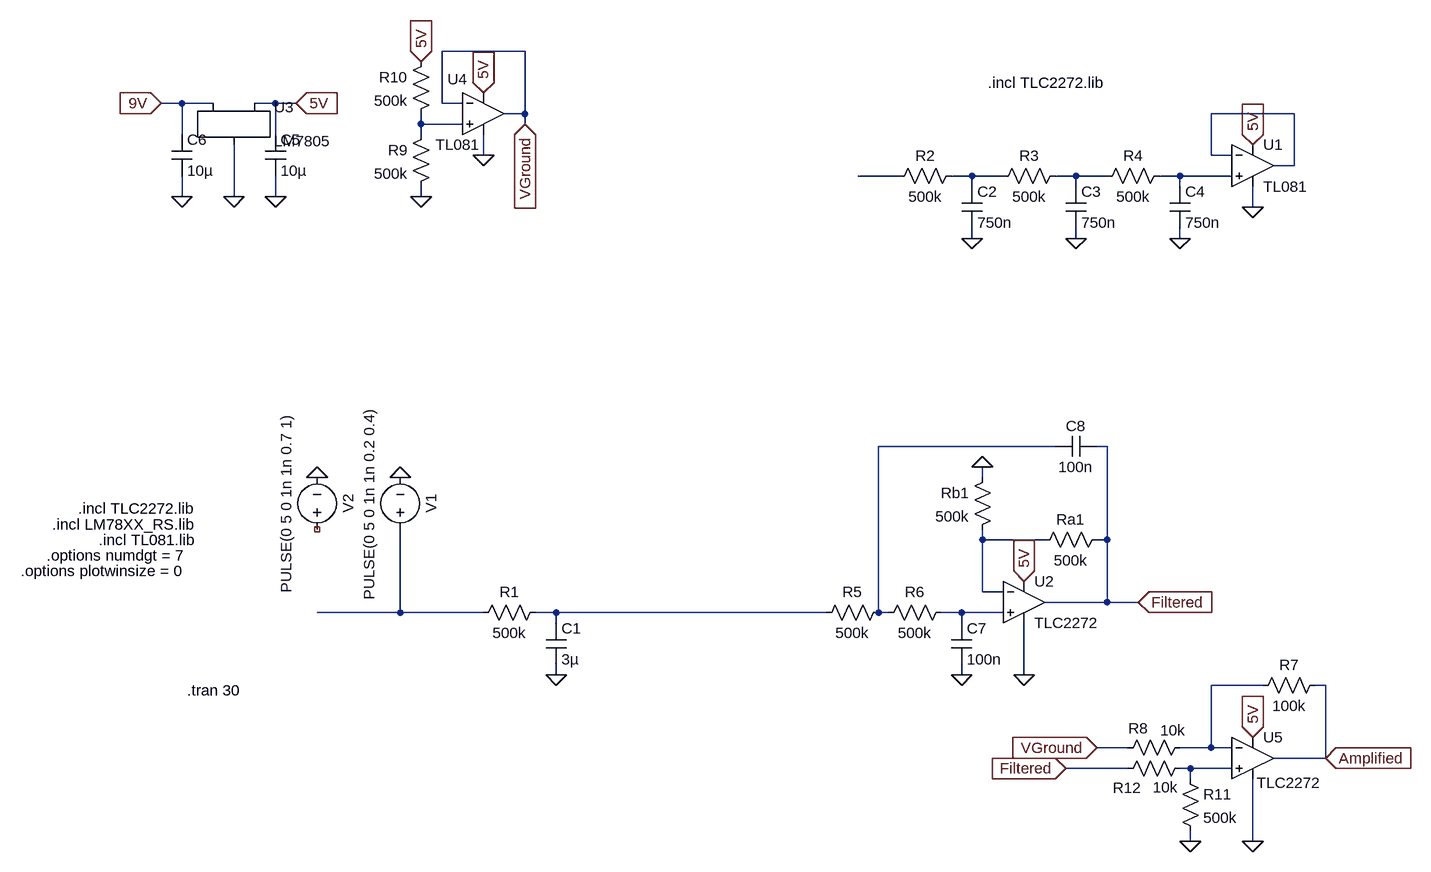
[diagram p0: schematic X_2ndOrderBPF_Schmitt - Copy.asc]
X_2ndOrderBPF_Schmitt - Copy.asc, the LTspice schematic file:
Version 4
SHEET 1 1824 680
WIRE -1088 -1696 -1216 -1696
WIRE -1616 -1616 -1648 -1616
WIRE -1568 -1616 -1616 -1616
WIRE -1472 -1616 -1504 -1616
WIRE -1440 -1616 -1472 -1616
WIRE -1216 -1616 -1216 -1696
WIRE -1184 -1616 -1216 -1616
WIRE -1088 -1600 -1088 -1696
WIRE -1088 -1600 -1120 -1600
WIRE 96 -1600 -32 -1600
WIRE -1248 -1584 -1248 -1600
WIRE -1184 -1584 -1248 -1584
WIRE -1088 -1584 -1088 -1600
WIRE -1616 -1568 -1616 -1616
WIRE -1472 -1568 -1472 -1616
WIRE -1248 -1568 -1248 -1584
WIRE -1152 -1536 -1152 -1568
WIRE -32 -1536 -32 -1600
WIRE 0 -1536 -32 -1536
WIRE 96 -1520 96 -1600
WIRE 96 -1520 64 -1520
WIRE -512 -1504 -576 -1504
WIRE -400 -1504 -432 -1504
WIRE -352 -1504 -400 -1504
WIRE -240 -1504 -272 -1504
WIRE -192 -1504 -240 -1504
WIRE -80 -1504 -112 -1504
WIRE 0 -1504 -80 -1504
WIRE -400 -1488 -400 -1504
WIRE -240 -1488 -240 -1504
WIRE -80 -1488 -80 -1504
WIRE -1616 -1472 -1616 -1504
WIRE -1536 -1472 -1536 -1552
WIRE -1472 -1472 -1472 -1504
WIRE -1248 -1472 -1248 -1488
WIRE 32 -1456 32 -1488
WIRE -400 -1408 -400 -1424
WIRE -240 -1408 -240 -1424
WIRE -80 -1408 -80 -1424
WIRE -272 -1088 -544 -1088
WIRE -192 -1088 -208 -1088
WIRE -384 -1040 -384 -1056
WIRE -384 -944 -384 -960
WIRE -288 -944 -384 -944
WIRE -192 -944 -192 -1088
WIRE -192 -944 -208 -944
WIRE -384 -864 -384 -944
WIRE -352 -864 -384 -864
WIRE -192 -848 -192 -944
WIRE -192 -848 -288 -848
WIRE -144 -848 -192 -848
WIRE -1280 -832 -1280 -960
WIRE -1280 -832 -1408 -832
WIRE -1152 -832 -1280 -832
WIRE -1040 -832 -1072 -832
WIRE -624 -832 -1040 -832
WIRE -544 -832 -544 -1088
WIRE -528 -832 -544 -832
WIRE -416 -832 -448 -832
WIRE -352 -832 -416 -832
WIRE -1040 -816 -1040 -832
WIRE -416 -816 -416 -832
WIRE -1040 -736 -1040 -752
WIRE -416 -736 -416 -752
WIRE -320 -736 -320 -816
WIRE 48 -720 -32 -720
WIRE 144 -720 128 -720
WIRE -160 -624 -208 -624
WIRE -32 -624 -32 -720
WIRE -32 -624 -80 -624
WIRE 0 -624 -32 -624
WIRE 144 -608 144 -720
WIRE 144 -608 64 -608
WIRE -160 -592 -256 -592
WIRE -64 -592 -80 -592
WIRE 0 -592 -64 -592
WIRE -64 -576 -64 -592
WIRE -64 -480 -64 -496
WIRE 32 -480 32 -576
FLAG -1040 -736 0
FLAG -400 -1408 0
FLAG -240 -1408 0
FLAG -80 -1408 0
FLAG -1280 -1040 0
FLAG -1408 -1040 0
FLAG 32 -1456 0
FLAG -1536 -1472 0
FLAG -1648 -1616 9V
IOPIN -1648 -1616 In
FLAG -1616 -1472 0
FLAG -1472 -1472 0
FLAG -1440 -1616 5V
IOPIN -1440 -1616 In
FLAG -1248 -1472 0
FLAG -1248 -1680 5V
IOPIN -1248 -1680 In
FLAG -1152 -1536 0
FLAG -1152 -1632 5V
IOPIN -1152 -1632 In
FLAG -1088 -1584 VGround
IOPIN -1088 -1584 In
FLAG 32 -1552 5V
IOPIN 32 -1552 In
FLAG -320 -736 0
FLAG -416 -736 0
FLAG -384 -1056 0
FLAG -320 -880 5V
IOPIN -320 -880 In
FLAG -144 -848 Filtered
IOPIN -144 -848 In
FLAG 32 -480 0
FLAG -64 -480 0
FLAG 32 -640 5V
IOPIN 32 -640 In
FLAG -256 -592 Filtered
IOPIN -256 -592 In
FLAG 144 -608 Amplified
IOPIN 144 -608 In
FLAG -208 -624 VGround
IOPIN -208 -624 In
SYMBOL res -1056 -848 R90
WINDOW 0 0 56 VBottom 2
WINDOW 3 32 56 VTop 2
SYMATTR InstName R1
SYMATTR Value 500k
SYMBOL cap -1056 -816 R0
SYMATTR InstName C1
SYMATTR Value 3µ
SYMBOL res -416 -1520 R90
WINDOW 0 0 56 VBottom 2
WINDOW 3 32 56 VTop 2
SYMATTR InstName R2
SYMATTR Value 500k
SYMBOL cap -416 -1488 R0
SYMATTR InstName C2
SYMATTR Value 750n
SYMBOL res -256 -1520 R90
WINDOW 0 0 56 VBottom 2
WINDOW 3 32 56 VTop 2
SYMATTR InstName R3
SYMATTR Value 500k
SYMBOL cap -256 -1488 R0
SYMATTR InstName C3
SYMATTR Value 750n
SYMBOL res -96 -1520 R90
WINDOW 0 0 56 VBottom 2
WINDOW 3 32 56 VTop 2
SYMATTR InstName R4
SYMATTR Value 500k
SYMBOL cap -96 -1488 R0
SYMATTR InstName C4
SYMATTR Value 750n
SYMBOL voltage -1280 -944 R180
WINDOW 0 -32 56 VBottom 2
WINDOW 3 32 56 VTop 2
WINDOW 123 0 0 Left 0
WINDOW 39 0 0 Left 0
SYMATTR InstName V1
SYMATTR Value PULSE(0 5 0 1n 1n 0.2 0.4)
SYMBOL voltage -1408 -944 R180
WINDOW 0 -32 56 VBottom 2
WINDOW 3 32 56 VTop 2
WINDOW 123 0 0 Left 0
WINDOW 39 0 0 Left 0
SYMATTR InstName V2
SYMATTR Value PULSE(0 5 0 1n 1n 0.7 1)
SYMBOL Opamps\\opamp2 32 -1584 R0
SYMATTR InstName U1
SYMATTR Value TL081
SYMBOL LM7805 -1536 -1600 R0
SYMATTR InstName U3
SYMBOL cap -1488 -1568 R0
SYMATTR InstName C5
SYMATTR Value 10µ
SYMBOL cap -1632 -1568 R0
SYMATTR InstName C6
SYMATTR Value 10µ
SYMBOL res -1232 -1584 M0
SYMATTR InstName R9
SYMATTR Value 500k
SYMBOL res -1232 -1696 M0
SYMATTR InstName R10
SYMATTR Value 500k
SYMBOL Opamps\\opamp2 -1152 -1664 R0
WINDOW 0 -55 11 Left 2
WINDOW 3 -74 112 Left 2
SYMATTR InstName U4
SYMATTR Value TL081
SYMBOL res -528 -848 R90
WINDOW 0 0 56 VBottom 2
WINDOW 3 32 56 VTop 2
SYMATTR InstName R5
SYMATTR Value 500k
SYMBOL cap -432 -816 R0
SYMATTR InstName C7
SYMATTR Value 100n
SYMBOL Opamps\\opamp2 -320 -912 R0
SYMATTR InstName U2
SYMATTR Value TLC2272
SYMBOL res -432 -848 R90
WINDOW 0 0 56 VBottom 2
WINDOW 3 32 56 VTop 2
SYMATTR InstName R6
SYMATTR Value 500k
SYMBOL res -192 -960 R90
WINDOW 0 0 56 VBottom 2
WINDOW 3 32 56 VTop 2
SYMATTR InstName Ra1
SYMATTR Value 500k
SYMBOL res -368 -1056 M0
SYMATTR InstName Rb1
SYMATTR Value 500k
SYMBOL cap -208 -1104 R90
WINDOW 0 0 32 VBottom 2
WINDOW 3 32 32 VTop 2
SYMATTR InstName C8
SYMATTR Value 100n
SYMBOL res 144 -736 R90
WINDOW 0 0 56 VBottom 2
WINDOW 3 32 56 VTop 2
SYMATTR InstName R7
SYMATTR Value 100k
SYMBOL res -64 -640 R90
WINDOW 0 2 80 VBottom 2
WINDOW 3 -26 27 VTop 2
SYMATTR InstName R8
SYMATTR Value 10k
SYMBOL Opamps\\opamp2 32 -672 R0
WINDOW 3 6 102 Left 2
SYMATTR Value TLC2272
SYMATTR InstName U5
SYMBOL res -80 -592 R0
SYMATTR InstName R11
SYMATTR Value 500k
SYMBOL res -64 -608 R90
WINDOW 0 61 97 VBottom 2
WINDOW 3 29 38 VTop 2
SYMATTR InstName R12
SYMATTR Value 10k
TEXT -1608 -712 Left 2 !.tran 30
TEXT -376 -1648 Left 2 !.incl TLC2272.lib
TEXT -1776 -992 Left 2 !.incl TLC2272.lib
TEXT -1816 -968 Left 2 !.incl LM78XX_RS.lib
TEXT -1744 -944 Left 2 !.incl TL081.lib
TEXT -1824 -920 Left 2 !.options numdgt = 7
TEXT -1864 -896 Left 2 !.options plotwinsize = 0

The netlist it stands for:
* X_2ndOrderBPF_Schmitt - Copy.asc
R1 N010 N009 500k
C1 N010 0 3µ
R2 N004 N003 500k
C2 N004 0 750n
R3 N005 N004 500k
C3 N005 0 750n
R4 N006 N005 500k
C4 N006 0 750n
V1 N009 0 PULSE(0 5 0 1n 1n 0.2 0.4)
V2 NC_01 0 PULSE(0 5 0 1n 1n 0.7 1)
XU1 N006 N001 5V 0 N001 TL081  ; pins In+ In- V+ V- OUT
XU3 9V 0 5V LM7805
C5 5V 0 10µ
C6 9V 0 10µ
R9 N002 0 500k
R10 5V N002 500k
XU4 N002 VGround 5V 0 VGround TL081  ; pins In+ In- V+ V- OUT
R5 N007 N010 500k
C7 N011 0 100n
XU2 N011 N008 5V 0 Filtered TLC2272  ; pins In+ In- V+ V- OUT
R6 N011 N007 500k
Ra1 Filtered N008 500k
Rb1 0 N008 500k
C8 Filtered N007 100n
R7 Amplified N012 100k
R8 N012 VGround 10k
XU5 N013 N012 5V 0 Amplified TLC2272  ; pins In+ In- V+ V- OUT
R11 N013 0 500k
R12 N013 Filtered 10k
.tran 30
.incl TLC2272.lib
.incl TLC2272.lib
.incl LM78XX_RS.lib
.incl TL081.lib
.options numdgt = 7
.options plotwinsize = 0
.backanno
.end